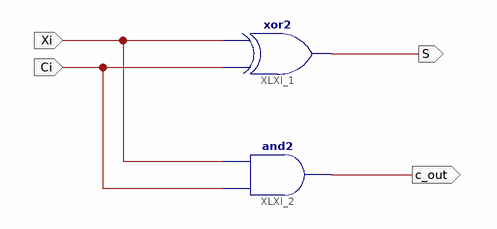
[diagram p0: schematic sheet 1]
// Xilinx ISE schematic ha.sch (spartan3e) as structural Verilog: 2 symbols, 4 ports
module ha (
  input  Xi,
  input  Ci,
  output S,
  output c_out
);

  xor XLXI_1 (S, Ci, Xi);
  and XLXI_2 (c_out, Ci, Xi);
endmodule
